# Altium project CCU.PrjPcb
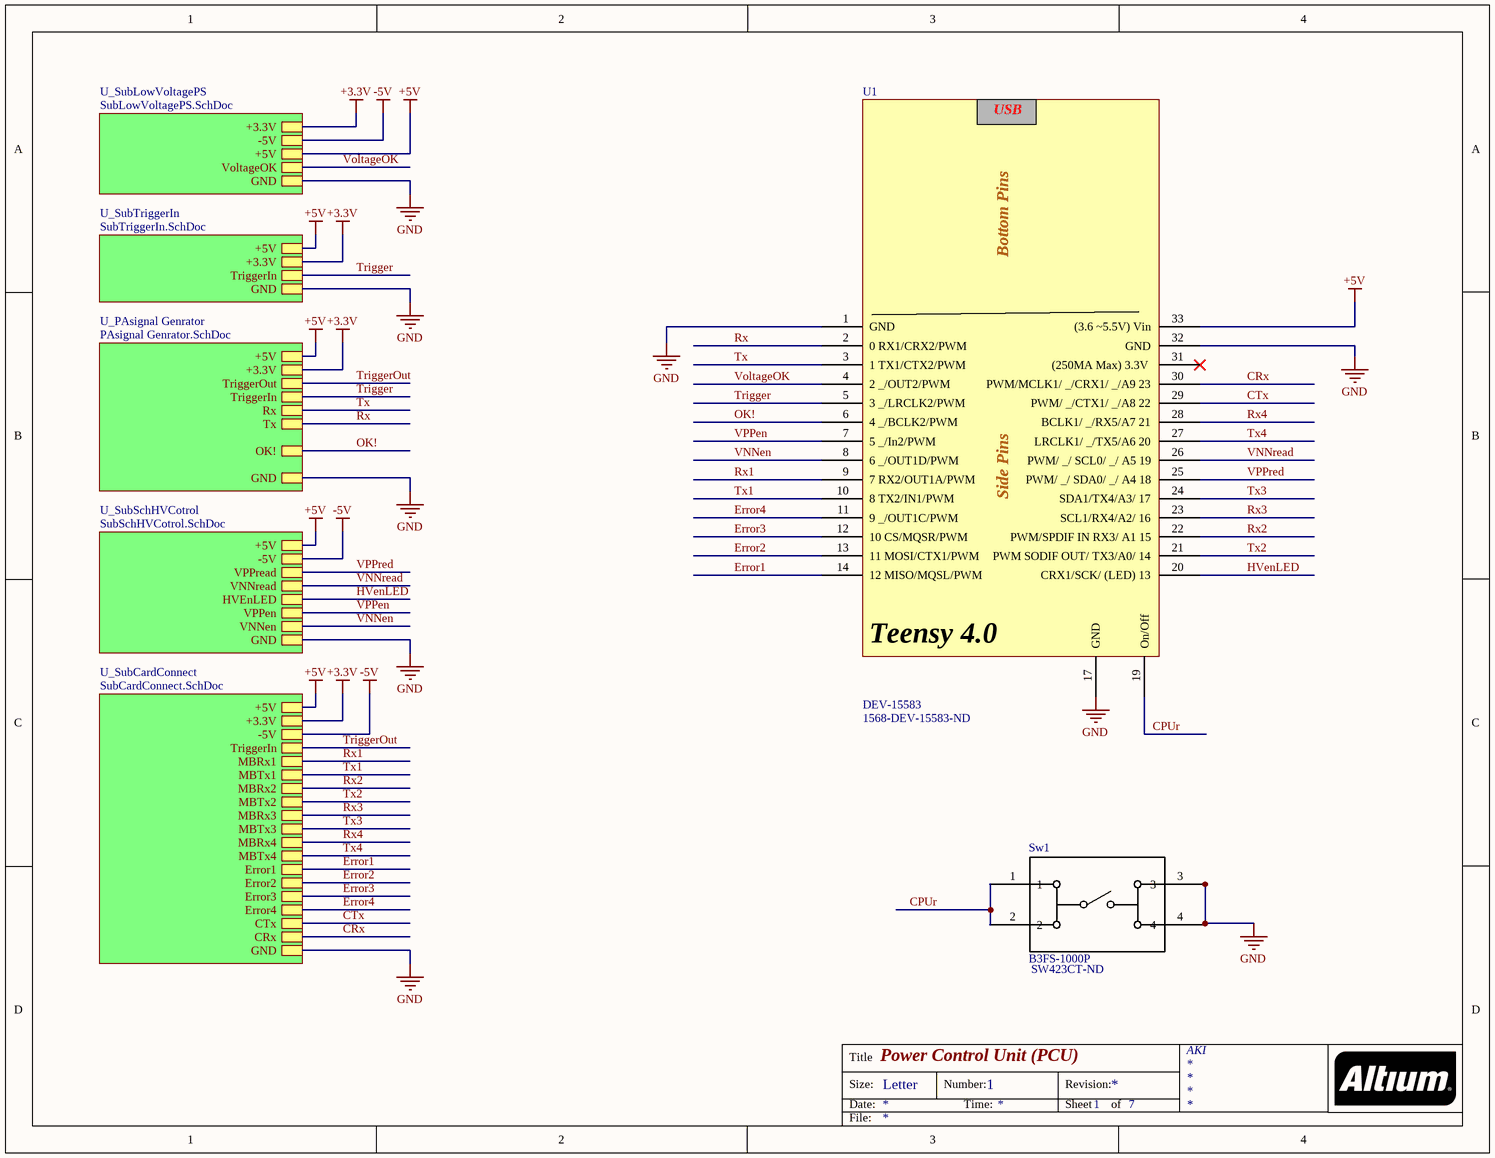
[diagram p0: MainSchPBv2.SchDoc]
3 sheets, 111 parts. Net scope: hierarchical (ports join the sheet entries above them; power ports are global).
Board file: PCUgen2.PcbDoc
Sheets:
  MainSchPBv2.SchDoc
    U_SubLowVoltagePS = SubLowVoltagePS.SchDoc
    U_SubTriggerIn = SubTriggerIn.SchDoc

## Sheet MainSchPBv2.SchDoc: Power Control Unit (PCU)
size Letter; Author: Afshin Kashani Ilkhechi; DrawnBy: AKI; Engineer: AKI; Organization: AKI; DocumentNumber: 1; SheetNumber: 1; SheetTotal: 7

### Parts
Sw1  B3FS-1000P  Supplier Part Number 1: SW423CT-ND  [B3FS-1000P]
U1  DEV-15583  Supplier Part Number 1: 1568-DEV-15583-ND  [Teensy 4.0sideOnly]

### Sub-sheets
U_PAsignal Genrator = PAsignal Genrator.SchDoc (file not in this document): TriggerOut, +5V, GND, TriggerIn, Rx, Tx, OK!, +3.3V
U_SubCardConnect = SubCardConnect.SchDoc (file not in this document): +5V, -5V, GND, TriggerIn, +3.3V, MBRx1, MBRx2, MBRx3, MBRx4, MBTx1, MBTx2, MBTx3, MBTx4, Error1, Error2, Error3, Error4, CTx, CRx
U_SubLowVoltagePS = SubLowVoltagePS.SchDoc: +3.3V, -5V, +5V, GND, VoltageOK
U_SubSchHVCotrol = SubSchHVCotrol.SchDoc (file not in this document): +5V, -5V, GND, VPPread, VNNread, VPPen, VNNen, HVEnLED
U_SubTriggerIn = SubTriggerIn.SchDoc: +5V, GND, +3.3V, TriggerIn

### Nets
+3.3V: sheet U_SubCardConnect/+3.3V, sheet U_SubLowVoltagePS/+3.3V, sheet U_SubTriggerIn/+3.3V, sheet U_PAsignal Genrator/+3.3V
+5V: U1.33((3.6_~5.5V)_Vin) ; sheet U_SubCardConnect/+5V, sheet U_SubSchHVCotrol/+5V, sheet U_SubLowVoltagePS/+5V, sheet U_SubTriggerIn/+5V, sheet U_PAsignal Genrator/+5V  [project net +5]
-5V: sheet U_SubCardConnect/-5V, sheet U_SubSchHVCotrol/-5V, sheet U_SubLowVoltagePS/-5V
GND: Sw1.3 Sw1.4 U1.1(GND) U1.17(GND) U1.32(GND) ; sheet U_SubCardConnect/GND, sheet U_SubSchHVCotrol/GND, sheet U_SubLowVoltagePS/GND, sheet U_SubTriggerIn/GND, sheet U_PAsignal Genrator/GND
CPUr: Sw1.1 Sw1.2 U1.19(On/Off)
CRx: U1.30(PWM/MCLK1/__/CRX1/__/A9_23) ; sheet U_SubCardConnect/CRx
CTx: U1.29(PWM/__/CTX1/__/A8_22) ; sheet U_SubCardConnect/CTx
Error1: U1.14(12_MISO/MQSL/PWM) ; sheet U_SubCardConnect/Error1
Error2: U1.13(11_MOSI/CTX1/PWM) ; sheet U_SubCardConnect/Error2
Error3: U1.12(10_CS/MQSR/PWM) ; sheet U_SubCardConnect/Error3
Error4: U1.11(9__/OUT1C/PWM) ; sheet U_SubCardConnect/Error4
HVenLED: U1.20(CRX1/SCK/_(LED)_13) ; sheet U_SubSchHVCotrol/HVEnLED
OK!: U1.6(4__/BCLK2/PWM) ; sheet U_PAsignal Genrator/OK!
Rx: U1.2(0_RX1/CRX2/PWM) ; sheet U_PAsignal Genrator/Tx
Rx1: U1.9(7_RX2/OUT1A/PWM) ; sheet U_SubCardConnect/MBRx1
Rx2: U1.22(PWM/SPDIF_IN_RX3/_A1_15) ; sheet U_SubCardConnect/MBRx2
Rx3: U1.23(SCL1/RX4/A2/_16) ; sheet U_SubCardConnect/MBRx3
Rx4: U1.28(BCLK1/__/RX5/A7_21) ; sheet U_SubCardConnect/MBRx4
Trigger: U1.5(3__/LRCLK2/PWM) ; sheet U_SubTriggerIn/TriggerIn, sheet U_PAsignal Genrator/TriggerIn
TriggerOut: sheet U_SubCardConnect/TriggerIn, sheet U_PAsignal Genrator/TriggerOut
Tx: U1.3(1_TX1/CTX2/PWM) ; sheet U_PAsignal Genrator/Rx
Tx1: U1.10(8_TX2/IN1/PWM) ; sheet U_SubCardConnect/MBTx1
Tx2: U1.21(PWM_SODIF_OUT/_TX3/A0/_14) ; sheet U_SubCardConnect/MBTx2
Tx3: U1.24(SDA1/TX4/A3/_17) ; sheet U_SubCardConnect/MBTx3
Tx4: U1.27(LRCLK1/__/TX5/A6_20) ; sheet U_SubCardConnect/MBTx4
VNNen: U1.8(6__/OUT1D/PWM) ; sheet U_SubSchHVCotrol/VNNen
VNNread: U1.26(PWM/__/_SCL0/__/_A5_19) ; sheet U_SubSchHVCotrol/VNNread
VoltageOK: U1.4(2__/OUT2/PWM) ; sheet U_SubLowVoltagePS/VoltageOK
VPPen: U1.7(5__/In2/PWM) ; sheet U_SubSchHVCotrol/VPPen
VPPred: U1.25(PWM/__/_SDA0/__/_A4_18) ; sheet U_SubSchHVCotrol/VPPread

Not connected (* = marked no-connect by the designer): U1 31((250MA_Max)_3.3V_)*

### Notes on the sheet
- Title
- Size:
- Date:
- Letter
- Number:
- Time:
- Revision:
- Sheet
- of
- File:
- (in symbol Teensy 4.0_SideOnly) USB; Bottom Pins; Side Pins; Teensy 4.0

### Library data of the parts
Sw1 = B3FS-1000P: Tactile Switch SPST-NO Top Actuated Surface Mount; Supplier 1: Digi-Key
U1 = Teensy 4.0_SideOnly: Supplier 1: Digi-Key

## Sheet SubLowVoltagePS.SchDoc
size A3; DocumentNumber: 3; SheetNumber: 3; SheetTotal: 7
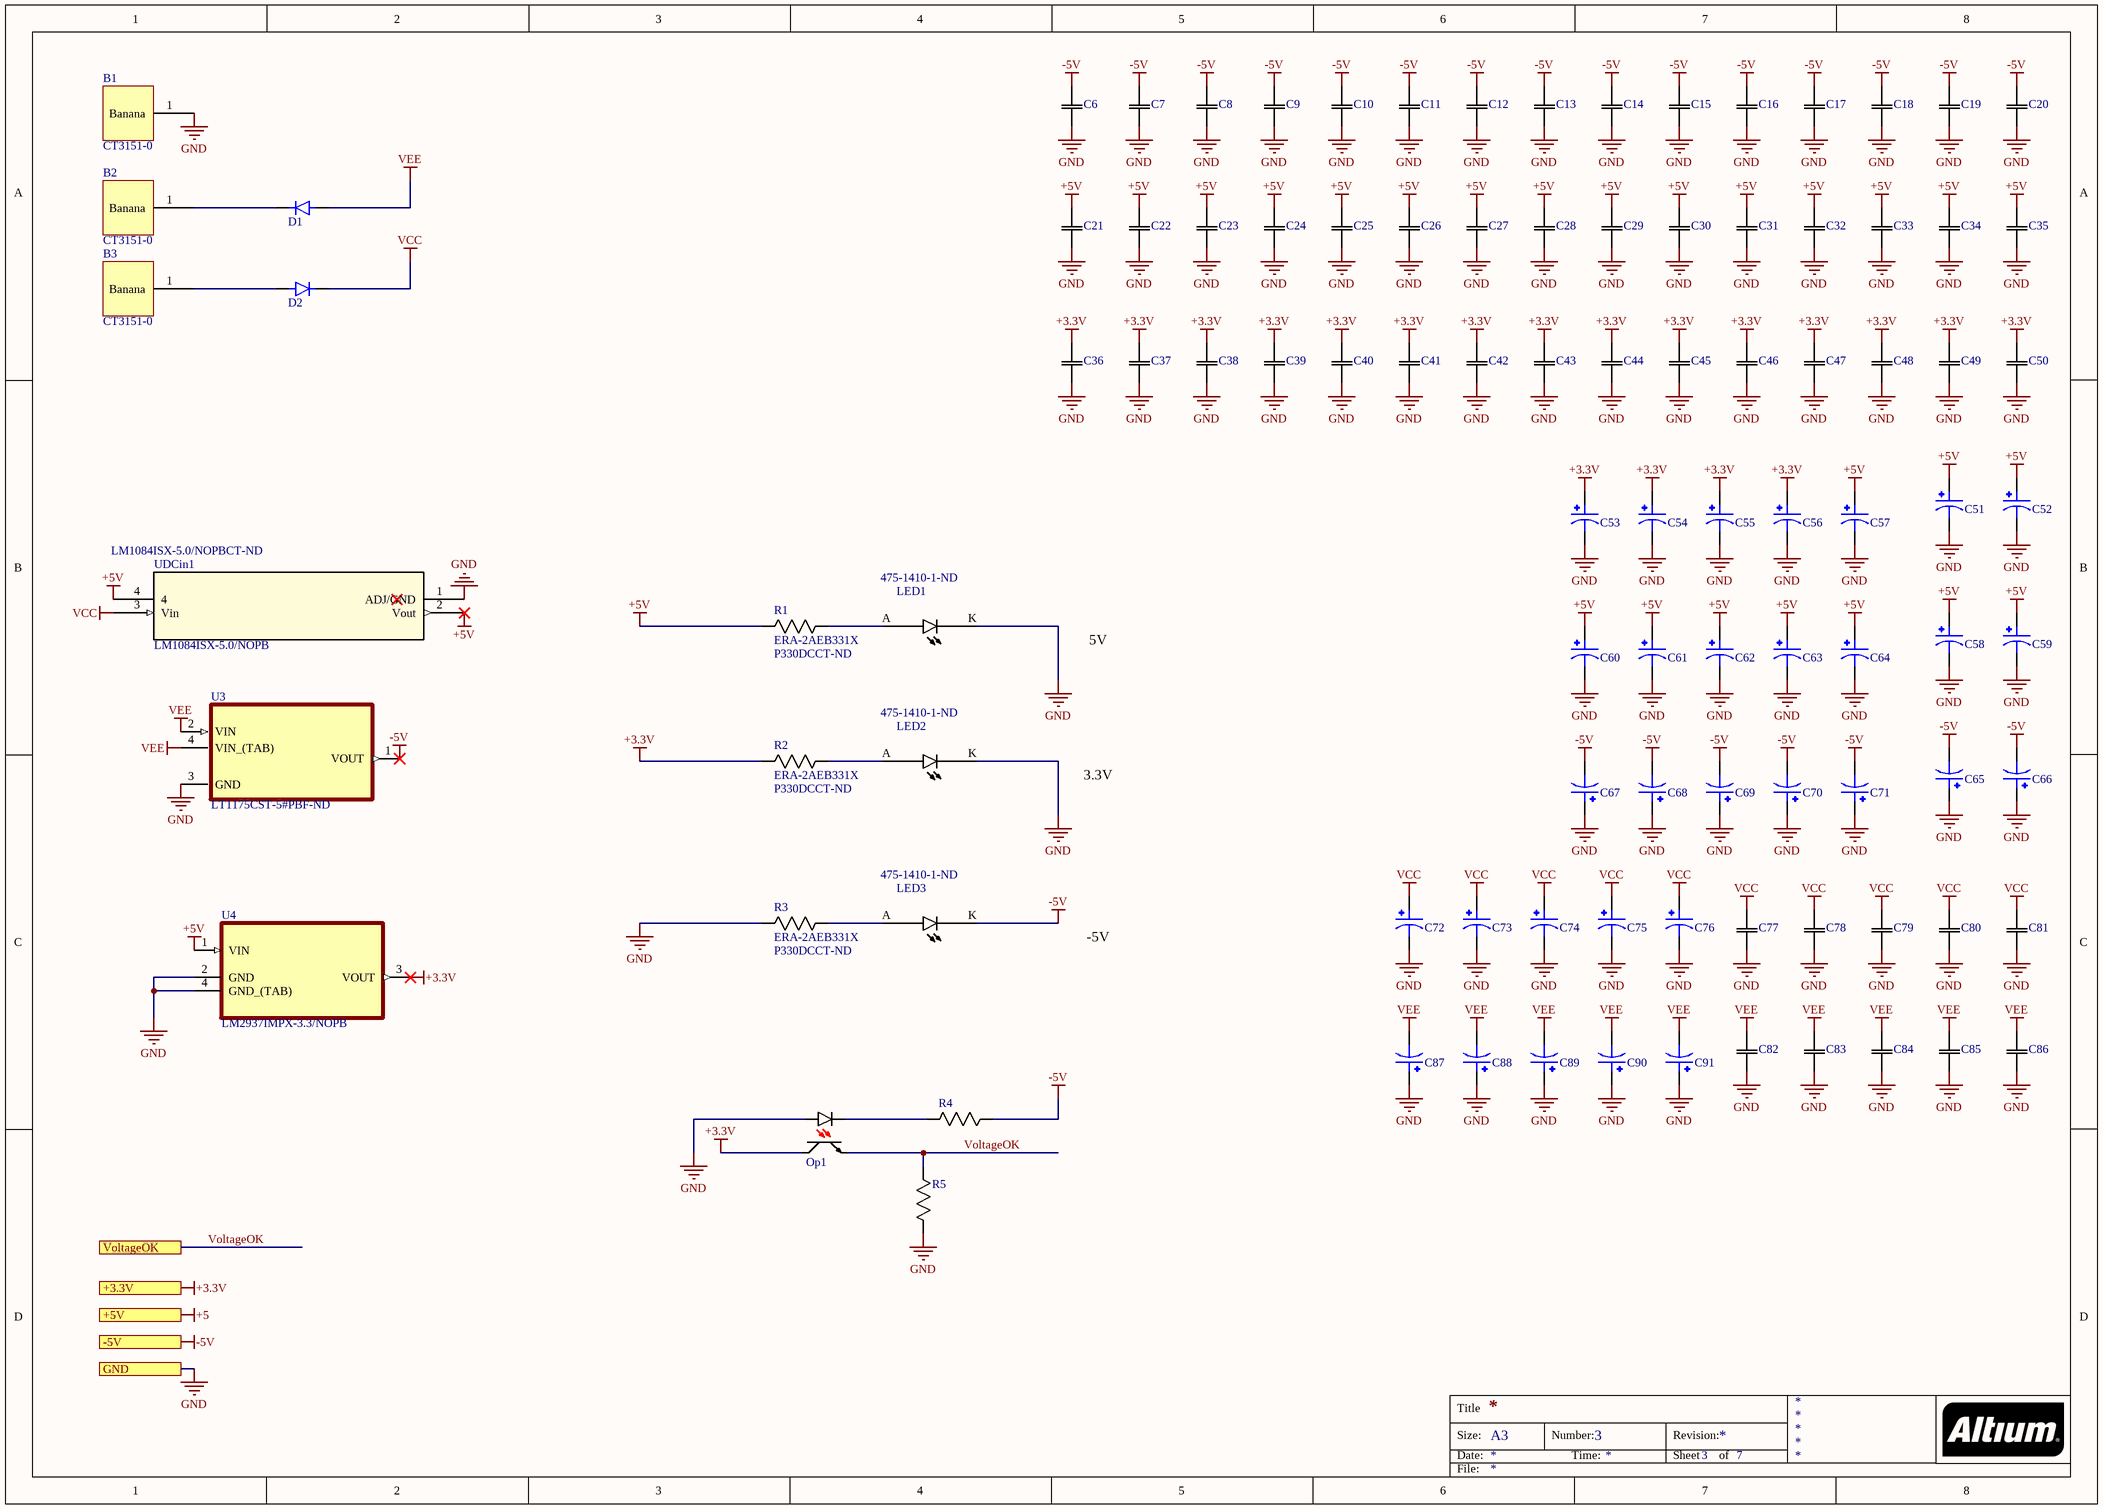
[diagram p1: SubLowVoltagePS.SchDoc]

### Parts
B1  CT3151-0  [CT3151L]
B2  CT3151-0  [CT3151L]
B3  CT3151-0  [CT3151L]
C6  GRM155R71H102KA01J  [C0402]  (value not drawn)
C7  GRM155R71H102KA01J  [C0402]  (value not drawn)
C8  GRM155R71H102KA01J  [C0402]  (value not drawn)
C9  GRM155R71H102KA01J  [C0402]  (value not drawn)
C10  GRM155R71H102KA01J  [C0402]  (value not drawn)
C11  GRM155R71C103MA01D  [C0402]  (value not drawn)
C12  GRM155R71C103MA01D  [C0402]  (value not drawn)
C13  GRM155R71C103MA01D  [C0402]  (value not drawn)
C14  GRM155R71C103MA01D  [C0402]  (value not drawn)
C15  GRM155R71C103MA01D  [C0402]  (value not drawn)
C16  C0805C104Z5VACTU  [C0805]  (value not drawn)
C17  C0805C104Z5VACTU  [C0805]  (value not drawn)
C18  C0805C104Z5VACTU  [C0805]  (value not drawn)
C19  C0805C104Z5VACTU  [C0805]  (value not drawn)
C20  C0805C104Z5VACTU  [C0805]  (value not drawn)
C21  GRM155R71H102KA01J  [C0402]  (value not drawn)
C22  GRM155R71H102KA01J  [C0402]  (value not drawn)
C23  GRM155R71H102KA01J  [C0402]  (value not drawn)
C24  GRM155R71H102KA01J  [C0402]  (value not drawn)
C25  GRM155R71H102KA01J  [C0402]  (value not drawn)
C26  GRM155R71C103MA01D  [C0402]  (value not drawn)
C27  GRM155R71C103MA01D  [C0402]  (value not drawn)
C28  GRM155R71C103MA01D  [C0402]  (value not drawn)
C29  GRM155R71C103MA01D  [C0402]  (value not drawn)
C30  GRM155R71C103MA01D  [C0402]  (value not drawn)
C31  C0805C104Z5VACTU  [C0805]  (value not drawn)
C32  C0805C104Z5VACTU  [C0805]  (value not drawn)
C33  C0805C104Z5VACTU  [C0805]  (value not drawn)
C34  C0805C104Z5VACTU  [C0805]  (value not drawn)
C35  C0805C104Z5VACTU  [C0805]  (value not drawn)
C36  GRM155R71H102KA01J  [C0402]  (value not drawn)
C37  GRM155R71H102KA01J  [C0402]  (value not drawn)
C38  GRM155R71H102KA01J  [C0402]  (value not drawn)
C39  GRM155R71H102KA01J  [C0402]  (value not drawn)
C40  GRM155R71H102KA01J  [C0402]  (value not drawn)
C41  GRM155R71C103MA01D  [C0402]  (value not drawn)
C42  GRM155R71C103MA01D  [C0402]  (value not drawn)
C43  GRM155R71C103MA01D  [C0402]  (value not drawn)
C44  GRM155R71C103MA01D  [C0402]  (value not drawn)
C45  GRM155R71C103MA01D  [C0402]  (value not drawn)
C46  C0805C104Z5VACTU  [C0805]  (value not drawn)
C47  C0805C104Z5VACTU  [C0805]  (value not drawn)
C48  C0805C104Z5VACTU  [C0805]  (value not drawn)
C49  C0805C104Z5VACTU  [C0805]  (value not drawn)
C50  C0805C104Z5VACTU  [C0805]  (value not drawn)
C51  T55A107M6R3C0200  [C1206]  (value not drawn)
C52  T55A107M6R3C0200  [C1206]  (value not drawn)
C53  T491A104K050AT  [C1206]  (value not drawn)
C54  T491A104K050AT  [C1206]  (value not drawn)
C55  T491A104K050AT  [C1206]  (value not drawn)
C56  T491A104K050AT  [C1206]  (value not drawn)
C57  T491A104K050AT  [C1206]  (value not drawn)
C58  T55A107M6R3C0200  [C1206]  (value not drawn)
C59  T55A107M6R3C0200  [C1206]  (value not drawn)
C60  T491A104K050AT  [C1206]  (value not drawn)
C61  T491A104K050AT  [C1206]  (value not drawn)
C62  T491A104K050AT  [C1206]  (value not drawn)
C63  T491A104K050AT  [C1206]  (value not drawn)
C64  T491A104K050AT  [C1206]  (value not drawn)
C65  T55A107M6R3C0200  [C1206]  (value not drawn)
C66  T55A107M6R3C0200  [C1206]  (value not drawn)
C67  T491A104K050AT  [C1206]  (value not drawn)
C68  T491A104K050AT  [C1206]  (value not drawn)
C69  T491A104K050AT  [C1206]  (value not drawn)
C70  T491A104K050AT  [C1206]  (value not drawn)
C71  T491A104K050AT  [C1206]  (value not drawn)
C72  F931D106MAA  [C1206]  (value not drawn)
C73  F931D106MAA  [C1206]  (value not drawn)
C74  F931D106MAA  [C1206]  (value not drawn)
C75  F931D106MAA  [C1206]  (value not drawn)
C76  F931D106MAA  [C1206]  (value not drawn)
C77  GRM155R71C103MA01D  [C0402]  (value not drawn)
C78  GRM155R71C103MA01D  [C0402]  (value not drawn)
C79  GRM155R71C103MA01D  [C0402]  (value not drawn)
C80  GRM155R71C103MA01D  [C0402]  (value not drawn)
C81  GRM155R71C103MA01D  [C0402]  (value not drawn)
C82  GRM155R71C103MA01D  [C0402]  (value not drawn)
C83  GRM155R71C103MA01D  [C0402]  (value not drawn)
C84  GRM155R71C103MA01D  [C0402]  (value not drawn)
C85  GRM155R71C103MA01D  [C0402]  (value not drawn)
C86  GRM155R71C103MA01D  [C0402]  (value not drawn)
C87  F931D106MAA  [C1206]  (value not drawn)
C88  F931D106MAA  [C1206]  (value not drawn)
C89  F931D106MAA  [C1206]  (value not drawn)
C90  F931D106MAA  [C1206]  (value not drawn)
C91  F931D106MAA  [C1206]  (value not drawn)
D1  CD1408-R11000  [CD1408]  (value not drawn)
D2  CD1408-R11000  [CD1408]  (value not drawn)
LED1  Supplier Part Number 1: 475-1410-1-ND  [LEDG0805]  (hidden comment: LG R971-KN-1)
LED2  Supplier Part Number 1: 475-1410-1-ND  [LEDG0805]  (hidden comment: LG R971-KN-1)
LED3  Supplier Part Number 1: 475-1410-1-ND  [LEDG0805]  (hidden comment: LG R971-KN-1)
Op1  TLP291(GB,SE  [4-SOIC]  (value not drawn)
R1  ERA-2AEB331X  Supplier Part Number 1: P330DCCT-ND  [0402]
R2  ERA-2AEB331X  Supplier Part Number 1: P330DCCT-ND  [0402]
R3  ERA-2AEB331X  Supplier Part Number 1: P330DCCT-ND  [0402]
R4  ERA-2AEB331X  [0402]  (value not drawn)
R5  RK73B1ETTP103J  [R0402]  (value not drawn)
U3  Supplier Part Number 1: LT1175CST-5#PBF-ND  [SOT230P700X180-4N]  (hidden comment: LT1175CST-5#PBF)
U4  LM2937IMPX-3.3/NOPB  [SOT230P700X180-4N]
UDCin1  LM1084ISX-5.0/NOPB  Supplier Part Number 1: LM1084ISX-5.0/NOPBCT-ND  [TS3B]

### Ports
+3.3V, +5V, -5V, GND, VoltageOK

### Nets
+3.3V: C36.2 C37.2 C38.2 C39.2 C40.2 C41.2 C42.2 C43.2 C44.2 C45.2 C46.2 C47.2 C48.2 C49.2 C50.2 C53.1(POS) C54.1(POS) C55.1(POS) C56.1(POS) Op1.4 R2.2 U4.3(VOUT) ; port +3.3V
+5: C21.2 C22.2 C23.2 C24.2 C25.2 C26.2 C27.2 C28.2 C29.2 C30.2 C31.2 C32.2 C33.2 C34.2 C35.2 C51.1(POS) C52.1(POS) C57.1(POS) C58.1(POS) C59.1(POS) C60.1(POS) C61.1(POS) C62.1(POS) C63.1(POS) C64.1(POS) R1.2 U4.1(VIN) UDCin1.2(Vout) UDCin1.4 ; port +5V  [also labelled +5V]
-5V: C6.2 C7.2 C8.2 C9.2 C10.2 C11.2 C12.2 C13.2 C14.2 C15.2 C16.2 C17.2 C18.2 C19.2 C20.2 C65.2(NEG) C66.2(NEG) C67.2(NEG) C68.2(NEG) C69.2(NEG) C70.2(NEG) C71.2(NEG) LED3.K(k) R4.1 U3.1(VOUT) ; port -5V
GND: B1.1(Banana) C6.1 C7.1 C8.1 C9.1 C10.1 C11.1 C12.1 C13.1 C14.1 C15.1 C16.1 C17.1 C18.1 C19.1 C20.1 C21.1 C22.1 C23.1 C24.1 C25.1 C26.1 C27.1 C28.1 C29.1 C30.1 C31.1 C32.1 C33.1 C34.1 C35.1 C36.1 C37.1 C38.1 C39.1 C40.1 C41.1 C42.1 C43.1 C44.1 C45.1 C46.1 C47.1 C48.1 C49.1 C50.1 C51.2(NEG) C52.2(NEG) C53.2(NEG) C54.2(NEG) C55.2(NEG) C56.2(NEG) C57.2(NEG) C58.2(NEG) C59.2(NEG) C60.2(NEG) C61.2(NEG) C62.2(NEG) C63.2(NEG) C64.2(NEG) C65.1(POS) C66.1(POS) C67.1(POS) C68.1(POS) C69.1(POS) C70.1(POS) C71.1(POS) C72.2(NEG) C73.2(NEG) C74.2(NEG) C75.2(NEG) C76.2(NEG) C77.1 C78.1 C79.1 C80.1 C81.1 C82.1 C83.1 C84.1 C85.1 C86.1 C87.1(POS) C88.1(POS) C89.1(POS) C90.1(POS) C91.1(POS) LED1.K(k) LED2.K(k) Op1.1 R3.2 R5.1 U3.3(GND) U4.2(GND) U4.4(GND_(TAB)) UDCin1.1(ADJ/GND) ; port GND
VCC: C72.1(POS) C73.1(POS) C74.1(POS) C75.1(POS) C76.1(POS) C77.2 C78.2 C79.2 C80.2 C81.2 D2.1 UDCin1.3(Vin)
VEE: C82.2 C83.2 C84.2 C85.2 C86.2 C87.2(NEG) C88.2(NEG) C89.2(NEG) C90.2(NEG) C91.2(NEG) D1.2 U3.2(VIN) U3.4(VIN_(TAB))
VoltageOK: Op1.3 R5.2 ; port VoltageOK
NetB2_1: B2.1(Banana) D1.1
NetB3_1: B3.1(Banana) D2.2
NetLED1_A: LED1.A R1.1
NetLED2_A: LED2.A R2.1
NetLED3_A: LED3.A R3.1
NetOp1_2: Op1.2 R4.2

### Notes on the sheet
- 5V
- 3.3V
- -5V
- Title
- Size:
- Date:
- A3
- Number:
- Time:
- Revision:
- Sheet
- of
- File:

### Library data of the parts
C6-C15 C21-C30 C36-C45 C77-C86 = Cap_0402: Supplier 1: Digi-Key
  C6-C10 C21-C25 C36-C40: Supplier Part Number 1: 490-6350-1-ND
  C11-C15 C26-C30 C41-C45 C77-C86: Supplier Part Number 1: 490-16353-1-ND
C16-C20 C31-C35 C46-C50 = Cap_0805: Supplier 1: Digi-Key; Supplier Part Number 1: 399-1177-1-ND
C51-C76 C87-C91 = Cap_1206: Tantalium
  C51 C52 C58 C59 C65 C66: Supplier 1: Mouser; Supplier Part Number 1: 74-T55A107M6R3C0200
  C53-C57 C60-C64 C67-C71: Supplier 1: Digi-Key; Supplier Part Number 1: 399-8263-1-ND
  C72-C76 C87-C91: Supplier 1: Digi-Key; Supplier Part Number 1: 478-8275-1-ND
D1 D2 = CD1408-R11000: Diode Standard 1000V 1A Surface Mount 1408; Supplier 1: Digi-Key; Supplier Part Number 1: CD1408-R11000CT-ND
LED1-LED3 = LED_0805: LED: / LH R974-LP-1 / LG R971-KN-1 / LY R976-PS-36; Supplier 1: Digi-Key
Op1 = TLP291: Supplier 1: Digi-Key; Supplier Part Number 1: TLP291(GBSE-ND
R1-R4 = Res_0805: Supplier 1: Digi-Key
  R4: Supplier Part Number 1: P330DCCT-ND
R5 = Res_0402: Supplier 1: Digi-Key; Supplier Part Number 1: 2019-RK73B1ETTP103JCT-ND
U3 = LT1175CST-5#PBF: IC REG LINEAR -5V 500MA SOT223-3; MP: LM2937IMPX-3.3/NOPB; MF: Texas Instruments; SnapEDA_Link: https://www.snapeda.com/parts/LM2937IMPX-3.3/NOPB/Texas%20Instruments/view-part/587827/?ref=snap; Package: SOT-223 Texas Instruments; Value: *; Availability: Unavailable; Price: None; Supplier 1: Digi-Key
U4 = LM2937IMPX-3.3/NOPB: Linear Voltage Regulator IC 1 Output 400mA SOT-223-4; MF: Texas Instruments; SnapEDA_Link: https://www.snapeda.com/parts/LM2937IMPX-3.3/NOPB/Texas%20Instruments/view-part/587827/?ref=snap; Package: SOT-223 Texas Instruments; MP: LM2937IMPX-3.3/NOPB; Value: *; Availability: Unavailable; Price: None
UDCin1 = LM1084ISX-5.0/NO: No Description Available; Vendor: Texas Instruments; Built_By: EMA_UL_Team; Manufacturer_Part_Number: LM1084ISX-5.0/NOPB; Copyright: Copyright (C) 2018 Accelerated Designs. All rights reserved; RefDes: RefDes; Type: DEV; Value: Value; Supplier 1: Digi-Key

## Sheet SubTriggerIn.SchDoc
size Letter; DocumentNumber: 7; SheetNumber: 7; SheetTotal: 7
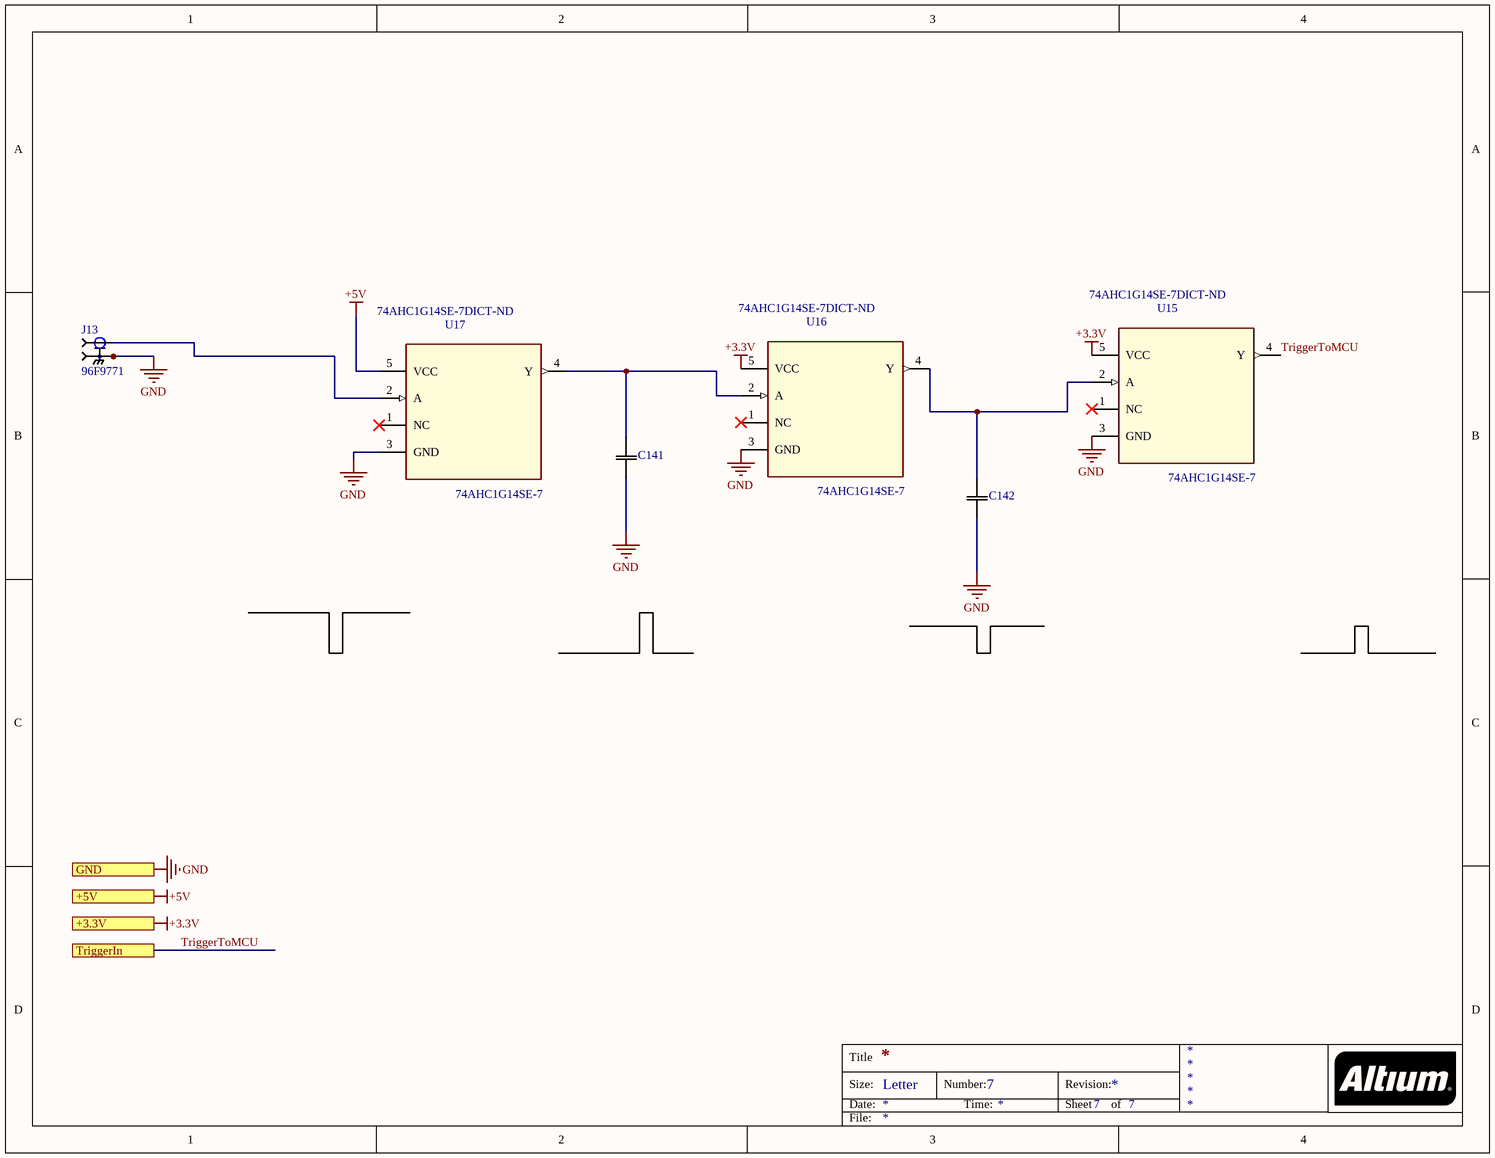
[diagram p2: SubTriggerIn.SchDoc]

### Parts
C141  GRM155R71C103MA01D  [C0402]  (value not drawn)
C142  GRM155R71C103MA01D  [C0402]  (value not drawn)
J13  Supplier Part Number 1: 96F9771  [SMBboardEdge]  (hidden comment: 131-3701-801)
U15  74AHC1G14SE-7  Supplier Part Number 1: 74AHC1G14SE-7DICT-ND  [*SOT65P210X110-5N]
U16  74AHC1G14SE-7  Supplier Part Number 1: 74AHC1G14SE-7DICT-ND  [*SOT65P210X110-5N]
U17  74AHC1G14SE-7  Supplier Part Number 1: 74AHC1G14SE-7DICT-ND  [*SOT65P210X110-5N]

### Ports
+3.3V, +5V, GND, TriggerIn

### Nets
+3.3V: U15.5(VCC) U16.5(VCC) ; port +3.3V
+5V: U17.5(VCC) ; port +5V  [project net +5]
GND: C141.1 C142.1 J13.SH1 J13.SH2 J13.SH3 J13.SH4 U15.3(GND) U16.3(GND) U17.3(GND) ; port GND
TriggerToMCU: U15.4(Y) ; port TriggerIn  [project net Trigger]
NetC141_2: C141.2 U16.2(A) U17.4(Y)
NetC142_2: C142.2 U15.2(A) U16.4(Y)
NetJ13_1: J13.1 U17.2(A)

Not connected (* = marked no-connect by the designer): U15 1(NC)*; U16 1(NC)*; U17 1(NC)*

### Notes on the sheet
- Title
- Size:
- Date:
- Letter
- Number:
- Time:
- Revision:
- Sheet
- of
- File:

### Library data of the parts
C141 C142 = Cap_0402: Supplier 1: Digi-Key; Supplier Part Number 1: 490-16353-1-ND
J13 = SMB: SMB Connector Jack, Male Pin 50Ohm Board Edge, End Launch Solder; Supplier 1: Newark
U15-U17 = 74AHC1G14SE-7: Inverter IC 1 Channel Schmitt Trigger SOT-353; MF: Diodes Inc.; Package: SOT-353 Diodes Inc.; MP: 74AHC1G14SE-7; Digi-Key_Part_Number: 74AHC1G14SE-7DICT-ND; Digi-Key_Purchase_URL: https://www.digikey.ca/product-detail/en/diodes-incorporated/74AHC1G14SE-7/74AHC1G14SE-7DICT-ND/2639309?utm_source=snapeda&utm_medium=aggregator&utm_campaign=symbol; SnapEDA_Link: https://www.snapeda.com/parts/74AHC1G14SE-7/Diodes%20Inc./view-part/418511/?ref=snap; Value: *; Supplier 1: Digi-Key

## Nets that join several sheets
+3.3V: SubLowVoltagePS (22 pins), SubTriggerIn (U15.5 U16.5)
+5: MainSchPBv2 (U1.33), SubLowVoltagePS (29 pins), SubTriggerIn (U17.5)
GND: MainSchPBv2 (5 pins), SubLowVoltagePS (96 pins), SubTriggerIn (9 pins)
Trigger: MainSchPBv2 (U1.5), SubTriggerIn (U15.4)
VoltageOK: MainSchPBv2 (U1.4), SubLowVoltagePS (Op1.3 R5.2)